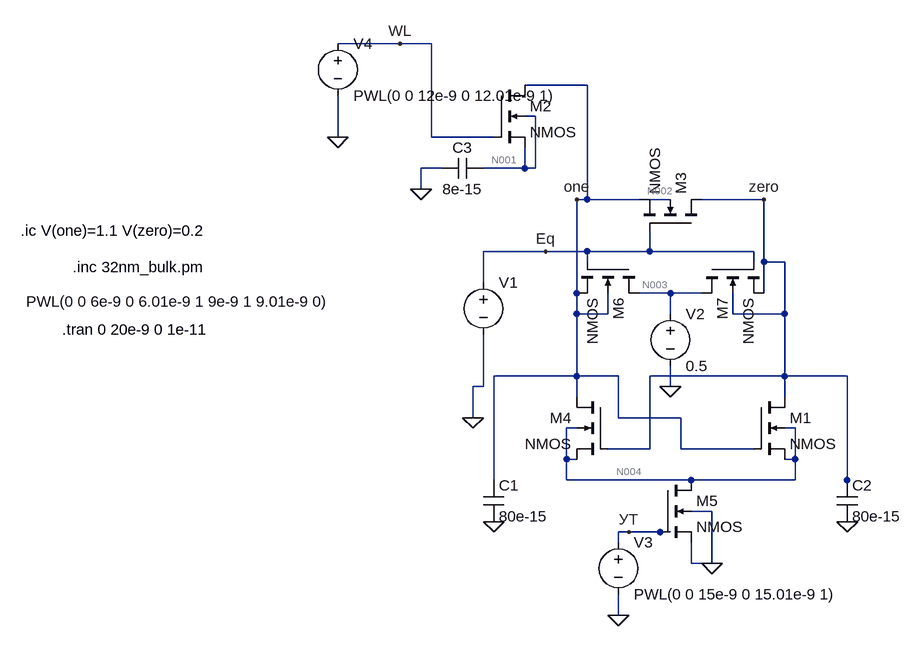
[diagram p0: schematic amplifaer.asc]
amplifaer.asc, the LTspice schematic file:
Version 4
SHEET 1 880 680
WIRE -112 -256 -208 -256
WIRE -64 -256 -112 -256
WIRE 176 -192 80 -192
WIRE 96 -144 80 -144
WIRE -208 -112 -208 -176
WIRE -64 -112 -64 -256
WIRE 32 -112 -64 -112
WIRE -48 -64 -80 -64
WIRE 80 -64 80 -96
WIRE 80 -64 16 -64
WIRE 96 -64 96 -144
WIRE 96 -64 80 -64
WIRE -80 -32 -80 -64
WIRE 176 -16 176 -192
WIRE 176 -16 160 -16
WIRE 256 -16 176 -16
WIRE 304 -16 272 -16
WIRE 448 -16 352 -16
WIRE 112 64 16 64
WIRE 176 64 112 64
WIRE 272 64 272 32
WIRE 272 64 176 64
WIRE 432 64 272 64
WIRE 176 80 176 64
WIRE 432 80 432 64
WIRE 448 80 448 -16
WIRE 480 80 448 80
WIRE 16 112 16 64
WIRE 160 128 160 -16
WIRE 304 128 256 128
WIRE 352 128 304 128
WIRE 448 128 448 80
WIRE 160 160 160 128
WIRE 208 160 208 128
WIRE 208 160 160 160
WIRE 304 160 304 128
WIRE 400 160 400 128
WIRE 480 160 480 80
WIRE 480 160 400 160
WIRE 160 256 160 160
WIRE 160 256 32 256
WIRE 224 256 160 256
WIRE 480 256 480 160
WIRE 480 256 272 256
WIRE 576 256 480 256
WIRE 16 272 16 192
WIRE 16 272 0 272
WIRE 304 272 304 240
WIRE 160 288 160 256
WIRE 480 288 480 256
WIRE 0 320 0 272
WIRE 224 320 224 256
WIRE 320 320 224 320
WIRE 160 336 144 336
WIRE 496 336 480 336
WIRE 272 368 272 256
WIRE 272 368 208 368
WIRE 320 368 320 320
WIRE 432 368 320 368
WIRE 144 384 144 336
WIRE 160 384 144 384
WIRE 496 384 496 336
WIRE 496 384 480 384
WIRE 32 416 32 256
WIRE 144 416 144 384
WIRE 336 416 144 416
WIRE 496 416 496 384
WIRE 496 416 336 416
WIRE 576 416 576 256
WIRE 576 432 576 416
WIRE 368 464 336 464
WIRE 240 496 224 496
WIRE 288 496 240 496
WIRE 304 496 288 496
WIRE 224 512 224 496
WIRE 336 544 336 512
WIRE 368 544 368 464
WIRE 368 544 336 544
WIRE 224 624 224 592
FLAG 0 320 0
FLAG 160 -16 one
FLAG 448 -16 zero
FLAG 304 272 0
FLAG 576 480 0
FLAG 32 480 0
FLAG 368 544 0
FLAG 224 624 0
FLAG -80 -32 0
FLAG -208 -112 0
FLAG 112 64 Eq
FLAG 240 496 УТ
FLAG -112 -256 WL
SYMBOL voltage 16 96 R0
WINDOW 3 -704 45 Left 2
WINDOW 123 0 0 Left 0
WINDOW 39 0 0 Left 0
SYMATTR Value PWL(0 0 6e-9 0 6.01e-9 1 9e-9 1 9.01e-9 0)
SYMATTR InstName V1
SYMBOL voltage 304 144 R0
WINDOW 123 0 0 Left 0
WINDOW 39 0 0 Left 0
SYMATTR InstName V2
SYMATTR Value 0.5
SYMBOL cap 16 416 R0
SYMATTR InstName C1
SYMATTR Value 80e-15
SYMBOL cap 560 416 R0
SYMATTR InstName C2
SYMATTR Value 80e-15
SYMBOL voltage 224 496 R0
WINDOW 123 0 0 Left 0
WINDOW 39 0 0 Left 0
SYMATTR InstName V3
SYMATTR Value PWL(0 0 15e-9 0 15.01e-9 1)
SYMBOL cap 16 -80 R90
WINDOW 0 0 32 VBottom 2
WINDOW 3 32 32 VTop 2
SYMATTR InstName C3
SYMATTR Value 8e-15
SYMBOL voltage -208 -272 R0
WINDOW 123 0 0 Left 0
WINDOW 39 0 0 Left 0
SYMATTR InstName V4
SYMATTR Value PWL(0 0 12e-9 0 12.01e-9 1)
SYMBOL nmos4 432 288 R0
SYMATTR InstName M1
SYMATTR Value2 l=32e-9 w=320e-9 ad=51200e-18 as=51200e-18 pd=960e-9 ps=960e-9
SYMBOL nmos4 32 -192 R0
SYMATTR InstName M2
SYMATTR Value2 l=32e-9 w=320e-9 ad=51200e-18 as=51200e-18 pd=960e-9 ps=960e-9
SYMBOL nmos4 352 32 M270
SYMATTR InstName M3
SYMATTR Value2 l=32e-9 w=320e-9 ad=51200e-18 as=51200e-18 pd=960e-9 ps=960e-9
SYMBOL nmos4 208 288 M0
SYMATTR InstName M4
SYMATTR Value2 l=32e-9 w=320e-9 ad=51200e-18 as=51200e-18 pd=960e-9 ps=960e-9
SYMBOL nmos4 288 416 R0
SYMATTR InstName M5
SYMATTR Value2 l=32e-9 w=320e-9 ad=51200e-18 as=51200e-18 pd=960e-9 ps=960e-9
SYMBOL nmos4 256 80 R90
SYMATTR InstName M6
SYMATTR Value2 l=32e-9 w=320e-9 ad=51200e-18 as=51200e-18 pd=960e-9 ps=960e-9
SYMBOL nmos4 352 80 M90
SYMATTR InstName M7
SYMATTR Value2 l=32e-9 w=320e-9 ad=51200e-18 as=51200e-18 pd=960e-9 ps=960e-9
TEXT -616 88 Left 2 !.inc 32nm_bulk.pm
TEXT -632 184 Left 2 !.tran 0 20e-9 0 1e-11
TEXT -696 32 Left 2 !.ic V(one)=1.1 V(zero)=0.2

The netlist it stands for:
* amplifaer.asc
V1 Eq 0 PWL(0 0 6e-9 0 6.01e-9 1 9e-9 1 9.01e-9 0)
V2 N003 0 0.5
C1 one 0 80e-15
C2 zero 0 80e-15
V3 УТ 0 PWL(0 0 15e-9 0 15.01e-9 1)
C3 N001 0 8e-15
V4 WL 0 PWL(0 0 12e-9 0 12.01e-9 1)
M1 zero one N004 N004 NMOS l=32e-9 w=320e-9 ad=51200e-18 as=51200e-18 pd=960e-9 ps=960e-9
M2 one WL N001 N001 NMOS l=32e-9 w=320e-9 ad=51200e-18 as=51200e-18 pd=960e-9 ps=960e-9
M3 zero Eq one N002 NMOS l=32e-9 w=320e-9 ad=51200e-18 as=51200e-18 pd=960e-9 ps=960e-9
M4 one zero N004 N004 NMOS l=32e-9 w=320e-9 ad=51200e-18 as=51200e-18 pd=960e-9 ps=960e-9
M5 N004 УТ 0 0 NMOS l=32e-9 w=320e-9 ad=51200e-18 as=51200e-18 pd=960e-9 ps=960e-9
M6 N003 Eq one one NMOS l=32e-9 w=320e-9 ad=51200e-18 as=51200e-18 pd=960e-9 ps=960e-9
M7 N003 Eq zero zero NMOS l=32e-9 w=320e-9 ad=51200e-18 as=51200e-18 pd=960e-9 ps=960e-9
.model NMOS NMOS
.model PMOS PMOS
.lib standard.mos
.inc 32nm_bulk.pm
.tran 0 20e-9 0 1e-11
.ic V(one)=1.1 V(zero)=0.2
.backanno
.end

* Results of the author's LTspice run, read from the files saved beside the schematic
* Operating Point, zero values left out:
*   V(n003) = 500 mV
*   V(one) = 1.1 V
*   V(zero) = 200 mV
*   V(n001) = 327.8 mV
*   V(n004) = 200 mV
*   V(n002) = 400.1 mV
*   Id(M7) = 109.3 pA
*   Ig(M7) = -86.52 pA
*   Is(M7) = -22.53 pA
*   Id(M6) = -516.9 nA
*   Ig(M6) = -3.469 nA
*   Ib(M6) = 517.2 nA
*   Is(M6) = 3.195 nA
*   Id(M5) = 1.568 nA
*   Ig(M5) = -4.702 pA
*   Is(M5) = -1.563 nA
*   Id(M4) = 68.09 nA
*   Ig(M4) = -1.043 nA
*   Is(M4) = -67.04 nA
*   Id(M3) = -2.837 nA
*   Ig(M3) = -3.098 nA
*   Is(M3) = 5.935 nA
*   Id(M2) = 3.113 nA
*   Ig(M2) = -3.113 nA
*   Id(M1) = -68.82 nA
*   Ig(M1) = 3.347 nA
*   Is(M1) = 65.48 nA
*   I(V4) = 3.113 nA
*   I(V3) = 4.702 pA
*   I(V2) = 516.8 nA
*   I(V1) = 6.654 nA
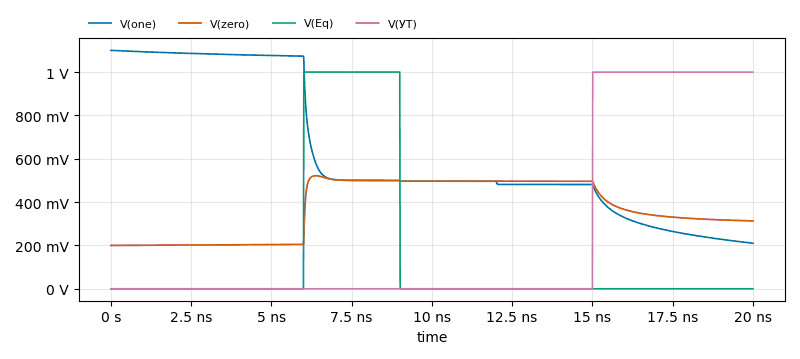
[diagram p1: Transient Analysis of amplifaer.asc, plotted from the saved traces]
* Transient Analysis, 1 run:
*   V(one): min 210.2 mV, max 1.1 V, average 622.7 mV, rms 699.6 mV, last 210.2 mV
*   V(zero): min 200 mV, max 521.6 mV, average 370.8 mV, rms 392.2 mV, last 313.2 mV
*   V(Eq): min 0 V, max 1 V, average 150 mV, rms 387.1 mV, last 0 V
*   V(УТ): min 0 V, max 1 V, average 249.7 mV, rms 499.7 mV, last 1 V